# Altium schematic sheet FM33LC0XX-NB-DEMOV1.0.SchDoc
size A3; SheetNumber: 0; SheetTotal: 0
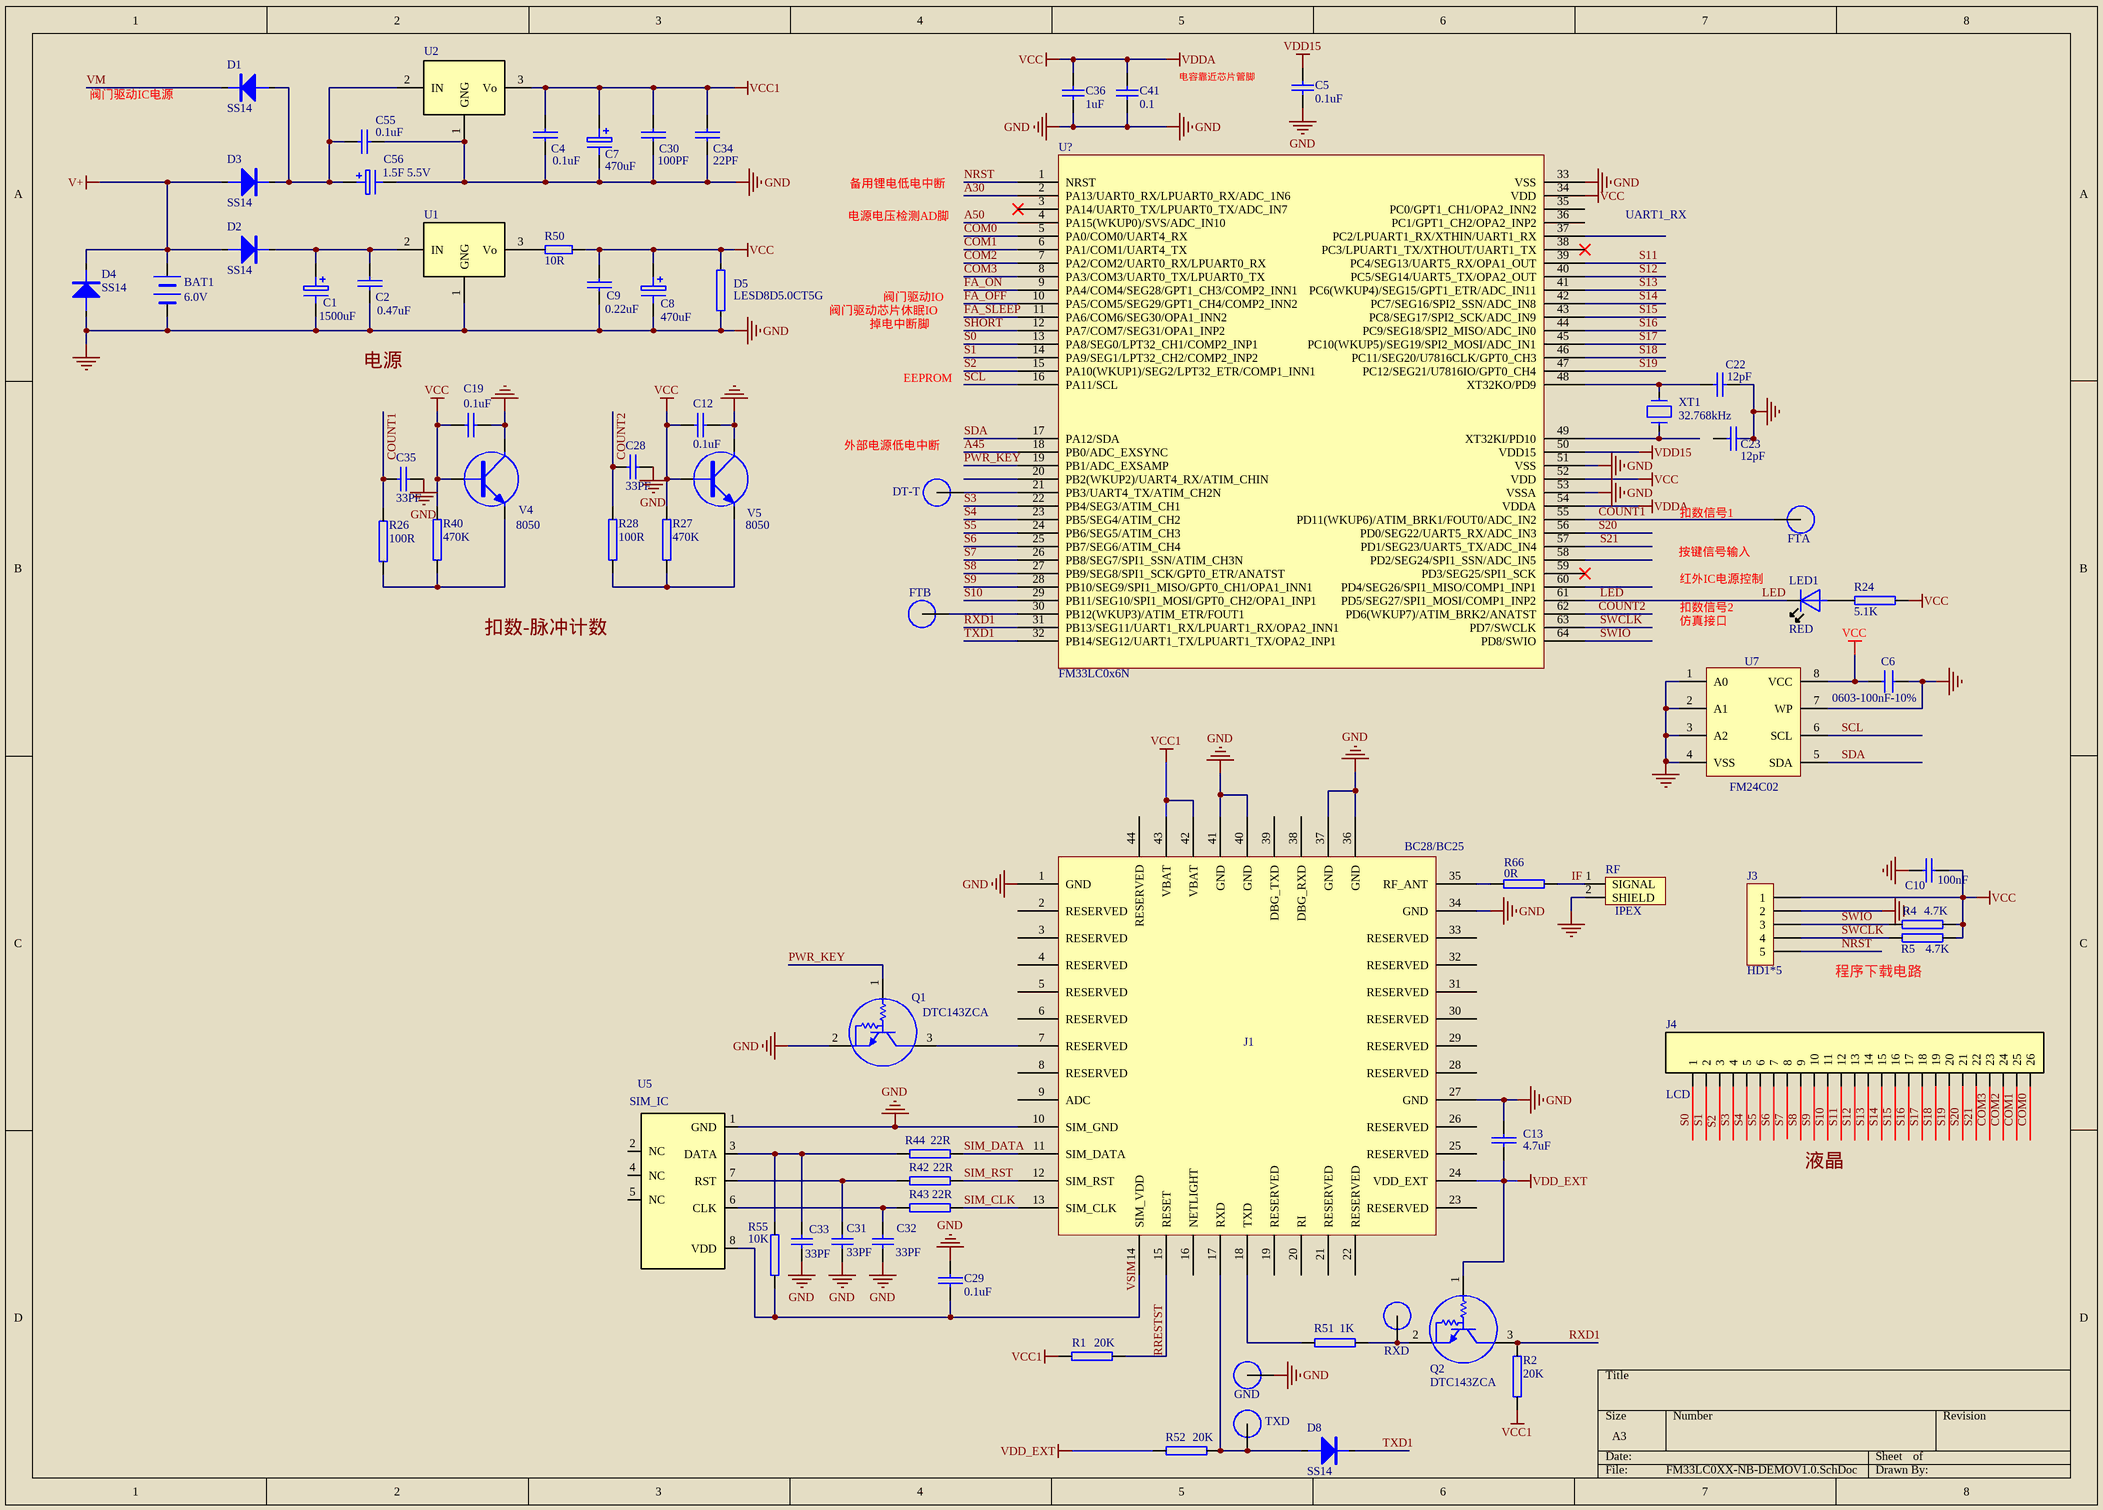
[diagram p0: FM33LC0XX-NB-DEMOV1.0.SchDoc]

## Parts
BAT1  6.0V  [SIP2B]
C1  1500uF  [10.0-2]
C2  0.47uF  [B0603]
C4  0.1uF  [B0603]
C5  0.1uF  [B0603]
C6  0603-100nF-10%  [B0603]
C7  (no value)  [6.3-2]
C8  470uF  [6.3-2]
C9  0.22uF  [B0603]
C10  100nF  [B0603]
C12  0.1uF  [B0603]
C13  4.7uF  [B0603]
C19  0.1uF  [B0603]
C22  12pF  [B0603]
C23  12pF  [B0603]
C28  33PF  [B0603]
C29  0.1uF  [B0603]
C30  100PF  [B0603]
C31  33pf  [B0603]
C32  33pf  [B0603]
C33  33pf  [B0603]
C34  22PF  [B0603]
C35  33PF  [B0603]
C36  1uF  [B0603]
C41  0.1  [B0603]
C55  0.1uF  [B0603]
C56  1.5F 5.5V  [ccc]
D1  SS14  [RC3B]
D2  SS14  [RC3B]
D3  SS14  [RC3B]
D4  SS14  [RC3B]
D5  LESD8D5.0CT5G  [0402]
D8  SS14  [SOD_123 L]
DT-T  TESTPOINT  [TESTPOINT]  (value not drawn)
FTA  TESTPOINT  [TESTPOINT]  (value not drawn)
FTB  TESTPOINT  [TESTPOINT]  (value not drawn)
GND  TESTPOINT  [TESTPOINT]  (value not drawn)
J1  BC28/BC25  [BC28]
J3  HD1*5  [SIP5]
J4  LCD  [lcd22]
LED1  RED
Q1  DTC143ZCA  [SOT23-3]
Q2  DTC143ZCA  [SOT23-3]
R1  22R  [B0603]  (value not drawn)
R2  22R  [B0603]  (value not drawn)
R4  4.7K  [B0603]
R5  4.7K  [B0603]
R24  5.1K  [B0603]
R26  100R  [B0603]
R27  470K  [B0603]
R28  100R  [B0603]
R40  470K  [B0603]
R42  22R  [B0603]
R43  22R  [B0603]
R44  22R  [B0603]
R50  10R  [B0603]
R51  22R  [B0603]  (value not drawn)
R52  22R  [B0603]  (value not drawn)
R55  22R  [B0603]  (value not drawn)
R66  22R  [B0603]  (value not drawn)
RF  IPEX  [IPEX]
RXD  TESTPOINT  [TESTPOINT]  (value not drawn)
TXD  TESTPOINT  [TESTPOINT]  (value not drawn)
U1  HT7533-1  [SOT89]  (value not drawn)
U2  SNM-ME6210APG  [SOT89]  (value not drawn)
U5  SIM_IC  [MFF2]
U7  FM24C02  [SOP8]
U?  FM33LC0x6N  [LQFP64]
V4  8050  [SOT-23]
V5  8050  [SOT-23]
XT1  32.768kHz  [X-3215]

## Nets
GND: BAT1.2(-) C1.2 C2.2 C4.2 C5.1 C6.1 C7.2 C8.2 C9.2 C10.1 C12.1 C13.2 C19.1 C22.2 C23.2 C28.2 C29.2 C30.2 C31.1 C32.1 C33.1 C34.2 C35.2 C36.2 C41.2 C55.2 C56.2 D4.1 D5.1 GND.1 J1.1(GND) J1.10(SIM_GND) J1.27(GND) J1.34(GND) J1.36(GND) J1.37(GND) J1.40(GND) J1.41(GND) J3.2 Q1.2(GND) RF.2(SHIELD) U1.1(GNG) U2.1(GNG) U5.1(GND) U7.1(A0) U7.2(A1) U7.3(A2) U7.4(VSS) U7.7(WP) U?.33(VSS) U?.51(VSS) U?.53(VSSA) V4.C V5.C
V+: BAT1.1(+) D2.1 D3.1 D4.2
VCC: C6.2 C8.1 C9.1 C10.2 C12.2 C19.2 C36.1 C41.1 D5.2 J3.1 R4.2 R5.1 R24.1 R27.1 R40.1 R50.2 U7.8(VCC) U?.34(VDD) U?.52(VDD) U?.54(VDDA) V4.B V5.B  [also labelled VDDA]
VCC1: C4.1 C7.1 C30.1 C34.1 J1.42(VBAT) J1.43(VBAT) R1.2 R2.2 U2.3(Vo)
VDD15: C5.2 U?.50(VDD15)
VDD_EXT: C13.1 J1.24(VDD_EXT) Q2.1(IN) R52.2
A30: U?.2(PA13/UART0_RX/LPUART0_RX/ADC_1N6)
A45: U?.18(PB0/ADC_EXSYNC)
A50: U?.4(PA15(WKUP0)/SVS/ADC_IN10)
COM0: J4.26 U?.5(PA0/COM0/UART4_RX)
COM1: J4.25 U?.6(PA1/COM1/UART4_TX)
COM2: J4.24 U?.7(PA2/COM2/UART0_RX/LPUART0_RX)
COM3: J4.23 U?.8(PA3/COM3/UART0_TX/LPUART0_TX)
COUNT1: C35.1 FTA.1 R26.2 U?.55(PD11(WKUP6)/ATIM_BRK1/FOUT0/ADC_IN2)
COUNT2: C28.1 R28.1 U?.62(PD6(WKUP7)/ATIM_BRK2/ANATST)
FA_OFF: U?.10(PA5/COM5/SEG29/GPT1_CH4/COMP2_INN2)
FA_ON: U?.9(PA4/COM4/SEG28/GPT1_CH3/COMP2_INN1)
FA_SLEEP: U?.11(PA6/COM6/SEG30/OPA1_INN2)
IF: R66.1 RF.1(SIGNAL)
LED: LED1.1 U?.61(PD5/SEG27/SPI1_MOSI/COMP1_INP2)
NRST: J3.5 U?.1(NRST)
PWR_KEY: Q1.1(IN) U?.19(PB1/ADC_EXSAMP)
RRESTST: J1.15(RESET) R1.1
RXD1: Q2.3(OUT) R2.1 U?.31(PB13/SEG11/UART1_RX/LPUART1_RX/OPA2_INN1)
S0: J4.1 U?.13(PA8/SEG0/LPT32_CH1/COMP2_INP1)
S1: J4.2 U?.14(PA9/SEG1/LPT32_CH2/COMP2_INP2)
S2: J4.3 U?.15(PA10(WKUP1)/SEG2/LPT32_ETR/COMP1_INN1)
S3: J4.4 U?.22(PB4/SEG3/ATIM_CH1)
S4: J4.5 U?.23(PB5/SEG4/ATIM_CH2)
S5: J4.6 U?.24(PB6/SEG5/ATIM_CH3)
S6: J4.7 U?.25(PB7/SEG6/ATIM_CH4)
S7: J4.8 U?.26(PB8/SEG7/SPI1_SSN/ATIM_CH3N)
S8: J4.9 U?.27(PB9/SEG8/SPI1_SCK/GPT0_ETR/ANATST)
S9: J4.10 U?.28(PB10/SEG9/SPI1_MISO/GPT0_CH1/OPA1_INN1)
S10: J4.11 U?.29(PB11/SEG10/SPI1_MOSI/GPT0_CH2/OPA1_INP1)
S11: J4.12 U?.39(PC4/SEG13/UART5_RX/OPA1_OUT)
S12: J4.13 U?.40(PC5/SEG14/UART5_TX/OPA2_OUT)
S13: J4.14 U?.41(PC6(WKUP4)/SEG15/GPT1_ETR/ADC_IN11)
S14: J4.15 U?.42(PC7/SEG16/SPI2_SSN/ADC_IN8)
S15: J4.16 U?.43(PC8/SEG17/SPI2_SCK/ADC_IN9)
S16: J4.17 U?.44(PC9/SEG18/SPI2_MISO/ADC_IN0)
S17: J4.18 U?.45(PC10(WKUP5)/SEG19/SPI2_MOSI/ADC_IN1)
S18: J4.19 U?.46(PC11/SEG20/U7816CLK/GPT0_CH3)
S19: J4.20 U?.47(PC12/SEG21/U7816IO/GPT0_CH4)
S20: J4.21 U?.56(PD0/SEG22/UART5_RX/ADC_IN3)
S21: J4.22 U?.57(PD1/SEG23/UART5_TX/ADC_IN4)
SCL: U7.6(SCL) U?.16(PA11/SCL)
SDA: U7.5(SDA) U?.17(PA12/SDA)
SHORT: U?.12(PA7/COM7/SEG31/OPA1_INP2)
SIM_CLK: J1.13(SIM_CLK) R43.2
SIM_DATA: J1.11(SIM_DATA) R44.1
SIM_RST: J1.12(SIM_RST) R42.2
SWCLK: J3.4 R5.2 U?.63(PD7/SWCLK)
SWIO: J3.3 R4.1 U?.64(PD8/SWIO)
TXD1: D8.2 U?.32(PB14/SEG12/UART1_TX/LPUART1_TX/OPA2_INP1)
VM: D1.2
VSIM: C29.1 J1.14(SIM_VDD) R55.1 U5.8(VDD)
NetC1_1: C1.1 C2.1 D2.2 U1.2(IN)
NetC22_1: C22.1 U?.48(XT32KO/PD9) XT1.1
NetC31_2: C31.2 R42.1 U5.7(RST)
NetC32_2: C32.2 R43.1 U5.6(CLK)
NetC33_2: C33.2 R44.2 R55.2 U5.3(DATA)
NetC55_1: C55.1 C56.1 D1.1 D3.2 U2.2(IN)
NetD8_1: D8.1 J1.17(RXD) R52.1 TXD.1
NetDT-T_1: DT-T.1 U?.21(PB3/UART4_TX/ATIM_CH2N)
NetFTB_1: FTB.1 U?.30(PB12(WKUP3)/ATIM_ETR/FOUT1)
NetJ1_7: J1.7(RESERVED) Q1.3(OUT)
NetJ1_18: J1.18(TXD) R51.2
NetJ1_35: J1.35(RF_ANT) R66.2
NetLED1_2: LED1.2 R24.2
NetQ2_2: Q2.2(GND) R51.1 RXD.1
NetR26_1: R26.1 R40.2 V4.E
NetR27_2: R27.2 R28.2 V5.E
NetR50_1: R50.1 U1.3(Vo)
NetU?_49: U?.49(XT32KI/PD10) XT1.2

Not connected (* = marked no-connect by the designer): C23 1; J1 2(RESERVED) 3(RESERVED) 4(RESERVED) 5(RESERVED) 6(RESERVED) 8(RESERVED) 9(ADC) 16(NETLIGHT) 19(RESERVED) 20(RI) 21(RESERVED) 22(RESERVED) 23(RESERVED) 25(RESERVED) 26(RESERVED) 28(RESERVED) 29(RESERVED) 30(RESERVED) 31(RESERVED) 32(RESERVED) 33(RESERVED) 38(DBG_RXD) 39(DBG_TXD) 44(RESERVED); U5 2(NC) 4(NC) 5(NC); U? 3(PA14/UART0_TX/LPUART0_TX/ADC_IN7)* 20(PB2(WKUP2)/UART4_RX/ATIM_CHIN) 35(PC0/GPT1_CH1/OPA2_INN2) 36(PC1/GPT1_CH2/OPA2_INP2) 37(PC2/LPUART1_RX/XTHIN/UART1_RX) 38(PC3/LPUART1_TX/XTHOUT/UART1_TX)* 58(PD2/SEG24/SPI1_SSN/ADC_IN5) 59(PD3/SEG25/SPI1_SCK)* 60(PD4/SEG26/SPI1_MISO/COMP1_INP1)

## Notes on the sheet
- 阀门驱动IC电源
- (near C41) 电容靠近芯片管脚
- 电源电压检测AD脚
- 备用锂电低电中断
- UART1_RX
- 阀门驱动芯片休眠IO
- 阀门驱动IO
- 电源
- 掉电中断脚
- EEPROM
- 外部电源低电中断
- 扣数信号1
- 按键信号输入
- 红外IC电源控制
- 扣数-脉冲计数
- (near U7) 仿真接口
- 扣数信号2
- 程序下载电路
- 液晶
- (in symbol ProF250.TMP_5.1K_23) 1K; 20K; 10K; 0R
- (in symbol ProF250.TMP_220_43) 470uF

## Library data of the parts
BAT1 = BATTERY
C1 C7 C8 C56 = ProF250.TMP_220_43
C2 C6 C22 C23 C55 = CAP: Capacitor
  C6: Value: 0603-100nF-10%
C4 C9 C12 C13 C19 C28-C30 C34 C35 = ProF250.TMP_0.22_4
C5 C31-C33 C36 C41 = Cap: Capacitor; Published: 8-Jun-2000; LatestRevisionDate: 17-Jul-2002; LatestRevisionNote: Re-released for DXP Platform.; PackageReference: RAD-0.3; Publisher: Altium Limited
  C31-C33: Value: 33PF
C10 = ProF250.TMP_0.1_40
D1-D4 D8 = DIODE
D5 = RES2: ESD保护二极管
J1 = BC28
J3 = CON5: Connector
J4 = CON22: Connector
LED1 = LED
Q1 Q2 = DTC143ZCA(数字三极管): Value: DTC143ZCA
R1 R2 R24 R42-R44 R51 R52 R55 R66 = ProF250.TMP_5.1K_23
R4 = ProF250.TMP_20K_36
R5 = ProF250.TMP_15K_35
R26-R28 R40 = ProF250.TMP_100K_9
R50 = R-NEW
RF = SMA
U1 U2 = 33A
U7 = 24LC08
V4 V5 = NPN
XT1 = XT